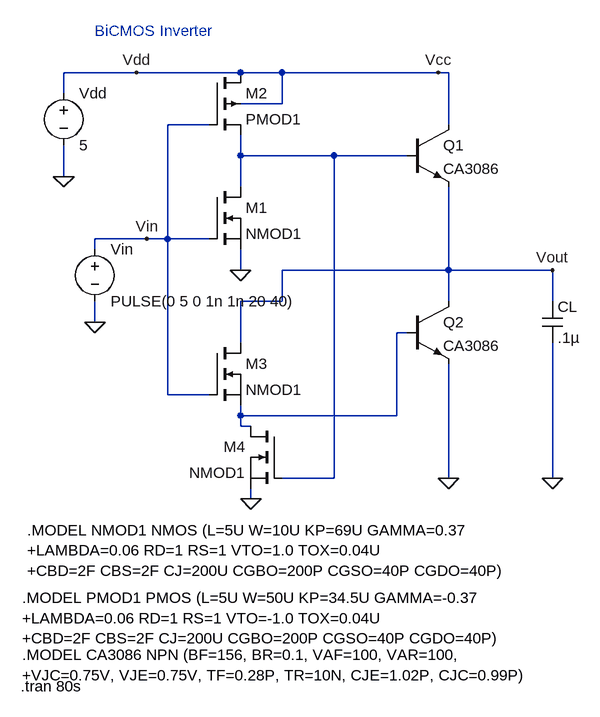
[diagram p0: schematic bicmos_inv_3_6.asc]
bicmos_inv_3_6.asc, the LTspice schematic file:
Version 4
SHEET 1 880 1024
WIRE 192 64 80 64
WIRE 352 64 192 64
WIRE 416 64 352 64
WIRE 656 64 416 64
WIRE 672 64 656 64
WIRE 80 96 80 64
WIRE 416 112 416 64
WIRE 416 112 352 112
WIRE 304 144 240 144
WIRE 672 144 672 64
WIRE 352 192 352 160
WIRE 496 192 352 192
WIRE 608 192 496 192
WIRE 80 224 80 176
WIRE 352 240 352 192
WIRE 208 320 128 320
WIRE 240 320 240 144
WIRE 240 320 208 320
WIRE 304 320 240 320
WIRE 128 336 128 320
WIRE 352 368 352 336
WIRE 672 368 672 240
WIRE 672 368 416 368
WIRE 832 368 672 368
WIRE 416 416 416 368
WIRE 416 416 352 416
WIRE 672 416 672 368
WIRE 832 416 832 368
WIRE 128 448 128 416
WIRE 608 464 592 464
WIRE 352 480 352 416
WIRE 240 560 240 320
WIRE 304 560 240 560
WIRE 352 592 352 576
WIRE 592 592 592 464
WIRE 592 592 352 592
WIRE 352 608 352 592
WIRE 368 608 352 608
WIRE 496 688 496 192
WIRE 496 688 416 688
WIRE 672 688 672 512
WIRE 832 688 832 480
WIRE 368 720 368 704
FLAG 352 368 0
FLAG 368 720 0
FLAG 672 688 0
FLAG 832 688 0
FLAG 128 448 0
FLAG 80 224 0
FLAG 832 368 Vout
FLAG 208 320 Vin
FLAG 656 64 Vcc
FLAG 192 64 Vdd
SYMBOL voltage 128 320 R0
WINDOW 123 0 0 Left 0
WINDOW 39 0 0 Left 0
SYMATTR InstName Vin
SYMATTR Value PULSE(0 5 0 1n 1n 20 40)
SYMBOL nmos 304 240 R0
SYMATTR InstName M1
SYMATTR Value NMOD1
SYMBOL pmos4 304 64 R0
SYMATTR InstName M2
SYMATTR Value PMOD1
SYMBOL npn 608 144 R0
SYMATTR InstName Q1
SYMATTR Value CA3086
SYMBOL npn 608 416 R0
SYMATTR InstName Q2
SYMATTR Value CA3086
SYMBOL nmos 304 480 R0
SYMATTR InstName M3
SYMATTR Value NMOD1
SYMBOL nmos 416 608 M0
SYMATTR InstName M4
SYMATTR Value NMOD1
SYMBOL voltage 80 80 R0
SYMATTR InstName Vdd
SYMATTR Value 5
SYMBOL cap 816 416 R0
SYMATTR InstName CL
SYMATTR Value .1µ
TEXT 128 0 Left 2 ;BiCMOS Inverter
TEXT 24 768 Left 2 !.MODEL NMOD1 NMOS (L=5U W=10U KP=69U GAMMA=0.37\n+LAMBDA=0.06 RD=1 RS=1 VTO=1.0 TOX=0.04U\n+CBD=2F CBS=2F CJ=200U CGBO=200P CGSO=40P CGDO=40P)
TEXT 16 872 Left 2 !.MODEL PMOD1 PMOS (L=5U W=50U KP=34.5U GAMMA=-0.37\n+LAMBDA=0.06 RD=1 RS=1 VTO=-1.0 TOX=0.04U\n+CBD=2F CBS=2F CJ=200U CGBO=200P CGSO=40P CGDO=40P)
TEXT 16 960 Left 2 !.MODEL CA3086 NPN (BF=156, BR=0.1, VAF=100, VAR=100,\n+VJC=0.75V, VJE=0.75V, TF=0.28P, TR=10N, CJE=1.02P, CJC=0.99P)
TEXT 14 1008 Left 2 !.tran 80s

The netlist it stands for:
* bicmos_inv_3_6.asc
Vin Vin 0 PULSE(0 5 0 1n 1n 20 40)
M1 N001 Vin 0 0 NMOD1
M2 Vdd Vin N001 Vdd PMOD1
Q1 Vdd N001 Vout 0 CA3086
Q2 Vout N002 0 0 CA3086
M3 Vout Vin N002 N002 NMOD1
M4 N002 N001 0 0 NMOD1
Vdd Vdd 0 5
CL Vout 0 .1µ
.model NPN NPN
.model PNP PNP
.lib standard.bjt
.model NMOS NMOS
.model PMOS PMOS
.lib standard.mos
* BiCMOS Inverter
.MODEL NMOD1 NMOS (L=5U W=10U KP=69U GAMMA=0.37
+LAMBDA=0.06 RD=1 RS=1 VTO=1.0 TOX=0.04U
+CBD=2F CBS=2F CJ=200U CGBO=200P CGSO=40P CGDO=40P)
.MODEL PMOD1 PMOS (L=5U W=50U KP=34.5U GAMMA=-0.37
+LAMBDA=0.06 RD=1 RS=1 VTO=-1.0 TOX=0.04U
+CBD=2F CBS=2F CJ=200U CGBO=200P CGSO=40P CGDO=40P)
.MODEL CA3086 NPN (BF=156, BR=0.1, VAF=100, VAR=100,
+VJC=0.75V, VJE=0.75V, TF=0.28P, TR=10N, CJE=1.02P, CJC=0.99P)
.tran 80s
.backanno
.end